# EAGLE design barrel (EAGLE 9.6.2)
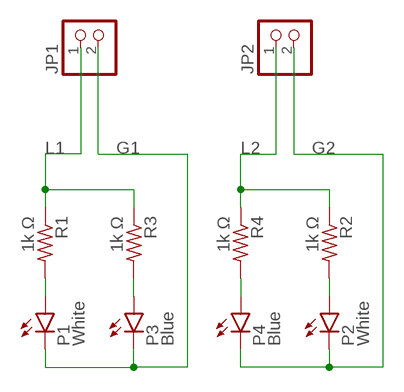
[diagram p0: schematic, sheet 1]

## Parts
JP1  PINHD-1X2  [1X02]
JP2  PINHD-1X2  [1X02]
P1  White  LEDCHIP-LED0805  [CHIP-LED0805]
P2  White  LEDCHIP-LED0805  [CHIP-LED0805]
P3  Blue  LEDCHIP-LED0805  [CHIP-LED0805]
P4  Blue  LEDCHIP-LED0805  [CHIP-LED0805]
R1  1k Ω  R-US_M0805  [M0805]
R2  1k Ω  R-US_M0805  [M0805]
R3  1k Ω  R-US_M0805  [M0805]
R4  1k Ω  R-US_M0805  [M0805]

## Nets
G1: JP1.2 P1.C P3.C
G2: JP2.2 P2.C P4.C
L1: JP1.1 R1.1 R3.1
L2: JP2.1 R2.1 R4.1
N$2: P1.A R1.2
N$4: P3.A R3.2
N$8: P2.A R2.2
N$10: P4.A R4.2

## Library data of the parts
JP1 JP2 = pinhead:PINHD-1X2: PIN HEADER
P1-P4 = led:LED: LED OSRAM: - CHIPLED LG R971, LG N971, LY N971, LG Q971, LY Q971, LO R971, LY R971 LH N974, LH R974 LS Q976, LO Q976, LY Q976 LO Q996 - Hyper CHIPLED LW Q18S LB Q993, LB Q99A, LB R99A - SideLED LS A670, LO A670, LY A670, LG A670, LP A670 LB A673, LV A673, LT A673, LW A673 LH A674 LY A675 LS A676, LA A676, LO A676, LY A676, LW A676 LS A679, LY A679, LG A679 - Hyper Micro SIDELED® LS Y876, LA Y876, LO Y876, LY Y876 LT Y87S - SmartLED LW L88C, LW L88S LB L89C, LB L89S, LG L890 LS L89K, LO L89K, LY L89K LS L896, LA L896, LO L896, LY L896 - TOPLED LS T670, LO T670, LY T670, LG T670, LP T670 LSG T670, LSP T670, LSY T670, LOP T670, LYG T670 LG T671, LOG T671, LSG T671 LB T673, LV T673, LT T673, LW T673 LH T674 LS T676, LA T676, LO T676, LY T676, LB T676, LH T676, LSB T676, LW T676 LB T67C, LV T67C, LT T67C, LS T67K, LO T67K, LY T67K, LW E67C LS E67B, LA E67B, LO E67B, LY E67B, LB E67C, LV E67C, LT E67C LW T67C LS T679, LY T679, LG T679 LS T770, LO T770, LY T770, LG T770, LP T770 LB T773, LV T773, LT T773, LW T773 LH T774 LS E675, LA E675, LY E675, LS T675 LS T776, LA T776, LO T776, LY T776, LB T776 LHGB T686 LT T68C, LB T68C - Hyper Mini TOPLED® LB M676 - Mini TOPLED Santana® LG M470 LS M47K, LO M47K, LY M47K Source: http://www.osram.convergy.de LUXEON: - LUMILED® LXK2-PW12-R00, LXK2-PW12-S00, LXK2-PW14-U00, LXK2-PW14-V00 LXK2-PM12-R00, LXK2-PM12-S00, LXK2-PM14-U00 LXK2-PE12-Q00, LXK2-PE12-R00, LXK2-PE12-S00, LXK2-PE14-T00, LXK2-PE14-U00 LXK2-PB12-K00, LXK2-PB12-L00, LXK2-PB12-M00, LXK2-PB14-N00, LXK2-PB14-P00, LXK2-PB14-Q00 LXK2-PR12-L00, LXK2-PR12-M00, LXK2-PR14-Q00, LXK2-PR14-R00 LXK2-PD12-Q00, LXK2-PD12-R00, LXK2-PD12-S00 LXK2-PH12-R00, LXK2-PH12-S00 LXK2-PL12-P00, LXK2-PL12-Q00, LXK2-PL12-R00 Source: www.luxeon.com KINGBRIGHT: KA-3528ASYC Source: www.kingbright.com
R1-R4 = rcl:R-US_: RESISTOR, American symbol; SPICEPREFIX: R

## Board
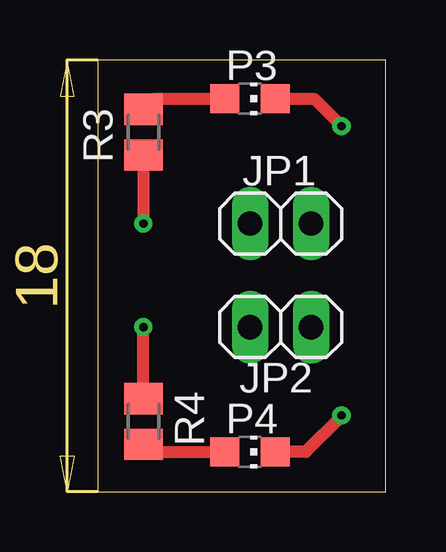
[diagram p1: board, top side]
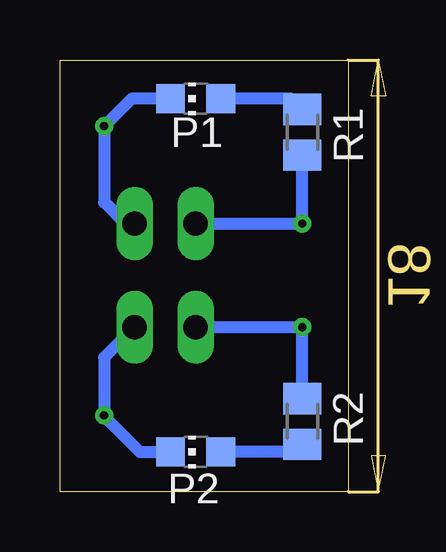
[diagram p2: board, bottom side, seen from below]

Size 12 x 18 mm. Coordinates in mm from the lower left corner, seen from the top.
Outline: 0,0 12,0 12,18 0,18 0,0
Copper layers (1*16): Top 0.035mm / dielectric 1.5mm / Bottom 0.035mm
Design rules "default": minimum track width 6mil, minimum drill 0.35mm, track to track 6mil, track to pad 6mil, pad to pad 6mil, via to via 6mil, smd to smd 6mil, copper to edge 40mil, drill to drill 6mil, minimum pad ring 10mil, minimum via ring 8mil, stop-mask expansion 4mil, vias tented up to drill 0mil, thermal gap 10mil

### Footprints (pad centres in the part's own frame; a part is rotated, then mirrored left to right if it is on the bottom)
1X02 = drill 1.016 long: 1 -1.27,0; 2 1.27,0
CHIP-LED0805 = smd 1.2 x 1.2: A 0,-1.05; C 0,1.05
M0805 = smd 1.3 x 1.6: 1 -0.95,0; 2 0.95,0

### Placement (x,y rotation side)
JP1  7.62,11.18 0 top
JP2  7.62,6.86 0 top
P1  6.35,16.38 90 bottom
P2  6.35,1.65 90 bottom
P3  6.35,16.38 270 top
P4  6.35,1.65 270 top
R1  1.91,14.99 90 bottom
R2  1.91,2.92 270 bottom
R3  1.91,14.99 90 top
R4  1.91,2.92 270 top

### Tracks (layer width: path | path; a pad name or v marks a point on that pad's centre or on a via)
G1  (via drill 0.35)
  Top 0.508: v10.16,15.24 9.02,16.38 P3.C
  Bottom 0.508: P3.C 9.02,16.38 v10.16,15.24 10.16,12.06 9.27,11.18 JP1.2
G2  (via drill 0.35)
  Top 0.508: v10.16,3.17 10.16,3.14 8.67,1.65 P4.C
  Bottom 0.508: JP2.2 10.16,5.59 v10.16,3.17 10.16,3.14 8.67,1.65 P4.C
L1  (via drill 0.35)
  Top 0.508: R3.1 v1.91,11.18
  Bottom 0.508: JP1.1 v1.91,11.18 R3.1
L2  (via drill 0.35)
  Top 0.508: R2.1 v1.91,6.86
  Bottom 0.508: JP2.1 v1.91,6.86 R2.1
N$2
  Bottom 0.508: R1.2 2.35,16.38 P1.A
N$4
  Top 0.508: R3.2 2.35,16.38 P3.A
N$8
  Bottom 0.508: R2.2 2.23,1.65 P2.A
N$10
  Top 0.508: R4.2 2.23,1.65 P4.A